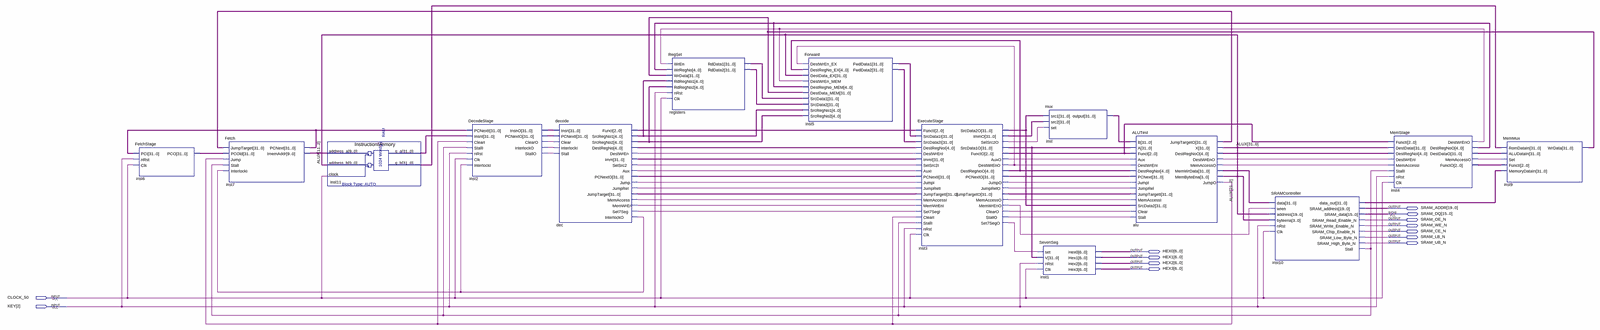
[diagram p0: schematic sheet, whole]
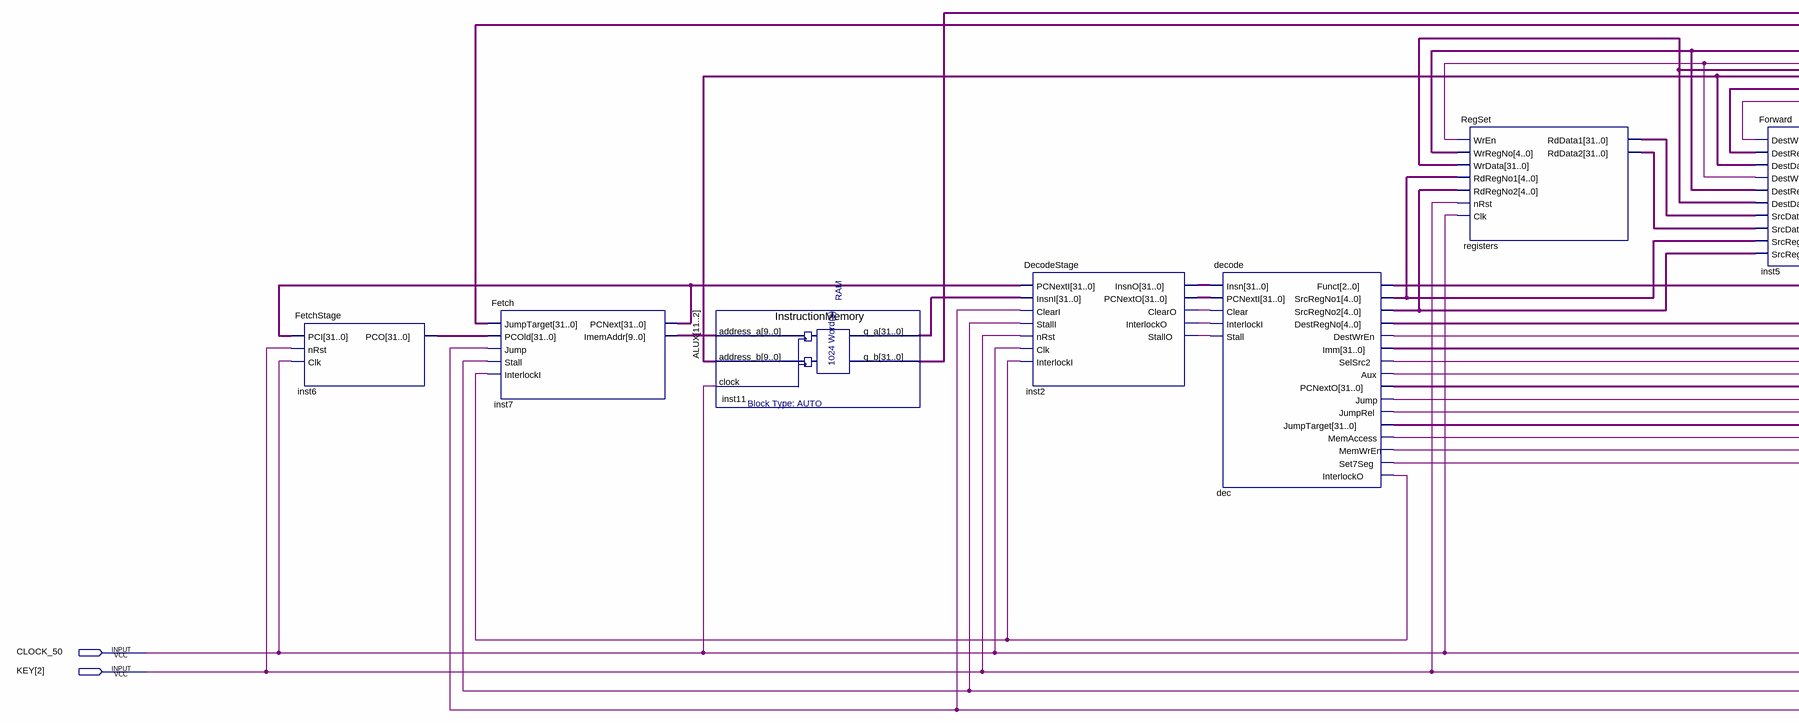
[diagram p1: schematic sheet, left part]
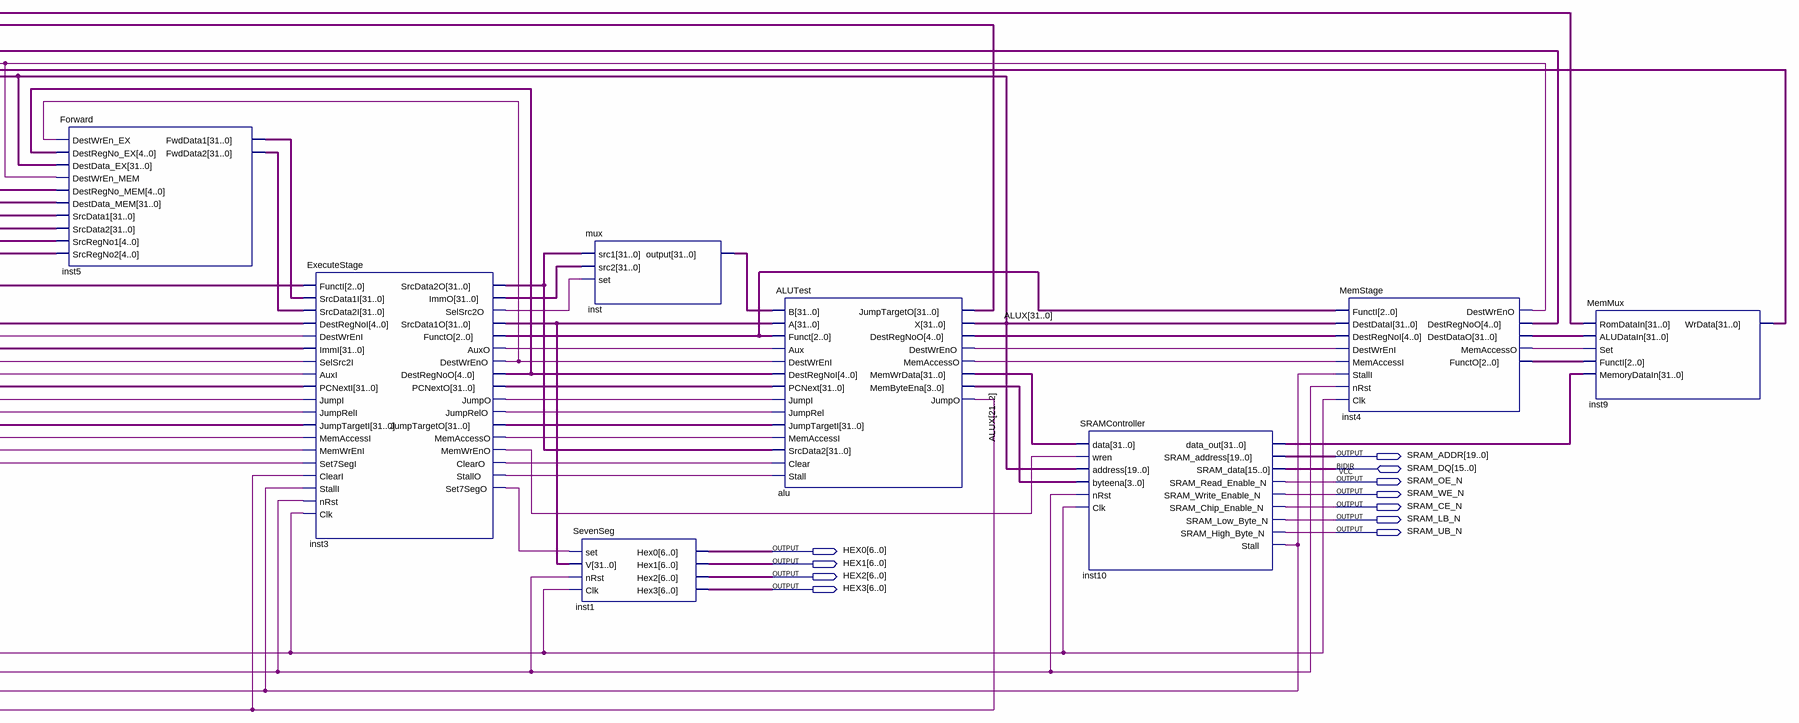
[diagram p2: schematic sheet, right part]
// Quartus schematic RISCV-1.bdf as structural Verilog: 14 symbols, 13 pins
module \RISCV-1  (
  input  CLOCK_50,
  input  [2:2] KEY,
  inout  [15:0] SRAM_DQ,
  output [19:0] SRAM_ADDR,
  output SRAM_OE_N,
  output SRAM_WE_N,
  output SRAM_CE_N,
  output SRAM_LB_N,
  output SRAM_UB_N,
  output [6:0] HEX0,
  output [6:0] HEX1,
  output [6:0] HEX2,
  output [6:0] HEX3
);

  wire alu_destwreno, alu_jumpo, alu_memaccesso, dec_aux, dec_destwren, dec_interlocko, dec_jump,
       dec_jumprel, dec_memaccess, dec_memwren, dec_selsrc2, dec_set7seg, inst2_clearo, inst2_interlocko,
       inst2_stallo, inst3_auxo, inst3_clearo, inst3_destwreno, inst3_jumpo, inst3_jumprelo,
       inst3_memaccesso, inst3_memwreno, inst3_selsrc2o, inst3_set7sego, inst3_stallo, inst4_destwreno,
       inst4_memaccesso, inst10_stall;
  wire [2:0] dec_funct, inst3_functo, inst4_functo;
  wire [3:0] alu_membyteena;
  wire [4:0] alu_destregnoo, dec_destregno, dec_srcregno1, dec_srcregno2, inst3_destregnoo, inst4_destregnoo;
  wire [9:0] inst7_imemaddr;
  wire [31:0] alu_jumptargeto, alu_memwrdata, ALUX, dec_imm, dec_jumptarget, dec_pcnexto, inst2_insno,
       inst2_pcnexto, inst3_immo, inst3_jumptargeto, inst3_pcnexto, inst3_srcdata1o, inst3_srcdata2o,
       inst4_destdatao, inst5_fwddata1, inst5_fwddata2, inst6_pco, inst7_pcnext, inst9_wrdata,
       inst10_data_out, inst11_q_a, inst11_q_b, inst_output, registers_rddata1, registers_rddata2;

  FetchStage inst6 (.PCI(inst7_pcnext), .nRst(KEY[2]), .Clk(CLOCK_50), .PCO(inst6_pco));
  Fetch inst7 (
    .JumpTarget(alu_jumptargeto), .PCOld(inst6_pco), .Jump(alu_jumpo), .Stall(inst10_stall),
    .InterlockI(dec_interlocko), .PCNext(inst7_pcnext), .ImemAddr(inst7_imemaddr));
  InstructionMemory inst11 (
    .address_a(inst7_imemaddr), .address_b(ALUX[11:2]), .clock(CLOCK_50), .q_a(inst11_q_a), .q_b(inst11_q_b));
  DecodeStage inst2 (
    .PCNextI(inst7_pcnext), .InsnI(inst11_q_a), .ClearI(alu_jumpo), .StallI(inst10_stall), .nRst(KEY[2]),
    .Clk(CLOCK_50), .InterlockI(dec_interlocko), .InsnO(inst2_insno), .PCNextO(inst2_pcnexto),
    .ClearO(inst2_clearo), .InterlockO(inst2_interlocko), .StallO(inst2_stallo));
  decode dec (
    .Insn(inst2_insno), .PCNextI(inst2_pcnexto), .Clear(inst2_clearo), .InterlockI(inst2_interlocko),
    .Stall(inst2_stallo), .Funct(dec_funct), .SrcRegNo1(dec_srcregno1), .SrcRegNo2(dec_srcregno2),
    .DestRegNo(dec_destregno), .DestWrEn(dec_destwren), .Imm(dec_imm), .SelSrc2(dec_selsrc2), .Aux(dec_aux),
    .PCNextO(dec_pcnexto), .Jump(dec_jump), .JumpRel(dec_jumprel), .JumpTarget(dec_jumptarget),
    .MemAccess(dec_memaccess), .MemWrEn(dec_memwren), .Set7Seg(dec_set7seg), .InterlockO(dec_interlocko));
  RegSet registers (
    .WrEn(inst4_destwreno), .WrRegNo(inst4_destregnoo), .WrData(inst9_wrdata), .RdRegNo1(dec_srcregno1),
    .RdRegNo2(dec_srcregno2), .nRst(KEY[2]), .Clk(CLOCK_50), .RdData1(registers_rddata1),
    .RdData2(registers_rddata2));
  Forward inst5 (
    .DestWrEn_EX(inst3_destwreno), .DestRegNo_EX(inst3_destregnoo), .DestData_EX(ALUX),
    .DestWrEn_MEM(inst4_destwreno), .DestRegNo_MEM(inst4_destregnoo), .DestData_MEM(inst9_wrdata),
    .SrcData1(registers_rddata1), .SrcData2(registers_rddata2), .SrcRegNo1(dec_srcregno1),
    .SrcRegNo2(dec_srcregno2), .FwdData1(inst5_fwddata1), .FwdData2(inst5_fwddata2));
  ExecuteStage inst3 (
    .FunctI(dec_funct), .SrcData1I(inst5_fwddata1), .SrcData2I(inst5_fwddata2), .DestRegNoI(dec_destregno),
    .DestWrEnI(dec_destwren), .ImmI(dec_imm), .SelSrc2I(dec_selsrc2), .AuxI(dec_aux), .PCNextI(dec_pcnexto),
    .JumpI(dec_jump), .JumpRelI(dec_jumprel), .JumpTargetI(dec_jumptarget), .MemAccessI(dec_memaccess),
    .MemWrEnI(dec_memwren), .Set7SegI(dec_set7seg), .ClearI(alu_jumpo), .StallI(inst10_stall), .nRst(KEY[2]),
    .Clk(CLOCK_50), .SrcData2O(inst3_srcdata2o), .ImmO(inst3_immo), .SelSrc2O(inst3_selsrc2o),
    .SrcData1O(inst3_srcdata1o), .FunctO(inst3_functo), .AuxO(inst3_auxo), .DestWrEnO(inst3_destwreno),
    .DestRegNoO(inst3_destregnoo), .PCNextO(inst3_pcnexto), .JumpO(inst3_jumpo), .JumpRelO(inst3_jumprelo),
    .JumpTargetO(inst3_jumptargeto), .MemAccessO(inst3_memaccesso), .MemWrEnO(inst3_memwreno),
    .ClearO(inst3_clearo), .StallO(inst3_stallo), .Set7SegO(inst3_set7sego));
  mux inst (.src1(inst3_srcdata2o), .src2(inst3_immo), .set(inst3_selsrc2o), .\output (inst_output));
  SevenSeg inst1 (
    .set(inst3_set7sego), .V(inst3_srcdata1o), .nRst(KEY[2]), .Clk(CLOCK_50), .Hex0(HEX0), .Hex1(HEX1),
    .Hex2(HEX2), .Hex3(HEX3));
  ALUTest alu (
    .B(inst_output), .A(inst3_srcdata1o), .Funct(inst3_functo), .Aux(inst3_auxo),
    .DestWrEnI(inst3_destwreno), .DestRegNoI(inst3_destregnoo), .PCNext(inst3_pcnexto), .JumpI(inst3_jumpo),
    .JumpRel(inst3_jumprelo), .JumpTargetI(inst3_jumptargeto), .MemAccessI(inst3_memaccesso),
    .SrcData2(inst3_srcdata2o), .Clear(inst3_clearo), .Stall(inst3_stallo), .JumpTargetO(alu_jumptargeto),
    .X(ALUX), .DestRegNoO(alu_destregnoo), .DestWrEnO(alu_destwreno), .MemAccessO(alu_memaccesso),
    .MemWrData(alu_memwrdata), .MemByteEna(alu_membyteena), .JumpO(alu_jumpo));
  SRAMController inst10 (
    .data(alu_memwrdata), .wren(inst3_memwreno), .address(ALUX[21:2]), .byteena(alu_membyteena),
    .nRst(KEY[2]), .Clk(CLOCK_50), .data_out(inst10_data_out), .SRAM_address(SRAM_ADDR),
    .SRAM_Read_Enable_N(SRAM_OE_N), .SRAM_Write_Enable_N(SRAM_WE_N), .SRAM_Chip_Enable_N(SRAM_CE_N),
    .SRAM_Low_Byte_N(SRAM_LB_N), .SRAM_High_Byte_N(SRAM_UB_N), .Stall(inst10_stall), .SRAM_data(SRAM_DQ));
  MemStage inst4 (
    .FunctI(inst3_functo), .DestDataI(ALUX), .DestRegNoI(alu_destregnoo), .DestWrEnI(alu_destwreno),
    .MemAccessI(alu_memaccesso), .StallI(inst10_stall), .nRst(KEY[2]), .Clk(CLOCK_50),
    .DestWrEnO(inst4_destwreno), .DestRegNoO(inst4_destregnoo), .DestDataO(inst4_destdatao),
    .MemAccessO(inst4_memaccesso), .FunctO(inst4_functo));
  MemMux inst9 (
    .RomDataIn(inst11_q_b), .ALUDataIn(inst4_destdatao), .Set(inst4_memaccesso), .FunctI(inst4_functo),
    .MemoryDataIn(inst10_data_out), .WrData(inst9_wrdata));
endmodule
